# Altium project PCB_Project1.PrjPCB
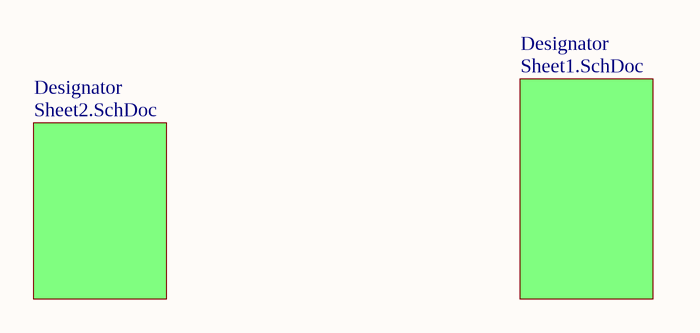
[diagram p0: Sheet3.SchDoc]
7 sheets, 94 parts. Net scope: global (net labels, ports and power ports of the same name join across sheets).
Board file: PCB1.PcbDoc
Sheets:
  Sheet3.SchDoc
    Designator = Sheet2.SchDoc
    Designator = Sheet1.SchDoc
  Power.SchDoc
  MCU.SchDoc
  Connection.SchDoc
  General.SchDoc

## Sheet Sheet3.SchDoc
size A3

### Sub-sheets
Designator = Sheet2.SchDoc: no entries
Designator = Sheet1.SchDoc: no entries

## Sheet Sheet2.SchDoc
size A3
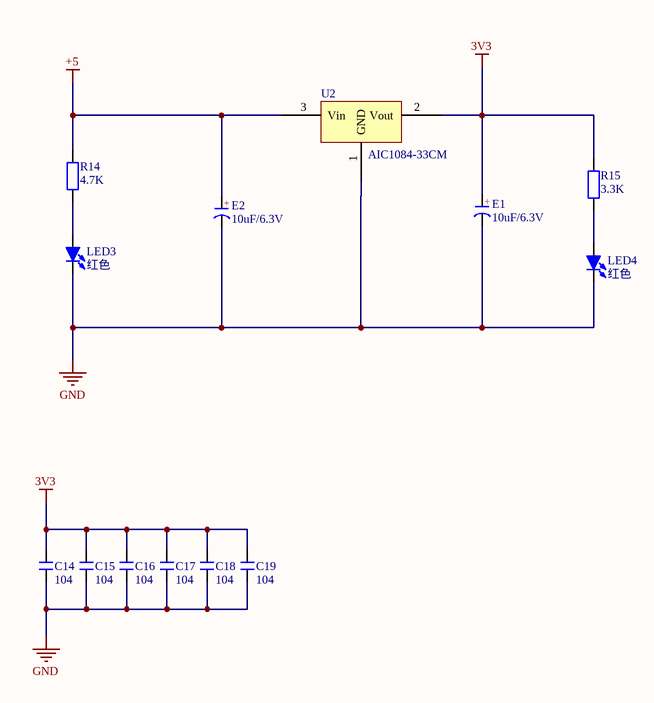
[diagram p1: Sheet2.SchDoc]

### Parts
C14  104  [C 0603_L]
C15  104  [C 0603_L]
C16  104  [C 0603_L]
C17  104  [C 0603_L]
C18  104  [C 0603_L]
C19  104  [C 0603_L]
E1  10uF/6.3V  [CD A(3216)]
E2  10uF/6.3V  [CD A(3216)]
LED3  红色  [LED 0603R]
LED4  红色  [LED 0603B]
R14  4.7K  [R 0603_L]
R15  3.3K  [R 0603_L]
U2  AIC1084-33CM  [TO263-3B]

### Nets
3V3: C14.2 C15.2 C16.2 C17.2 C18.2 C19.2 E1.1(A) R15.1 U2.2(Vout)  [project net VDDA]
+5: E2.1(A) R14.1 U2.3(Vin)
GND: C14.1 C15.1 C16.1 C17.1 C18.1 C19.1 E1.2(K) E2.2(K) LED3.2(K) LED4.2(K) U2.1(GND)  [project net VSSA]
NetLED3_1: LED3.1(A) R14.2
NetLED4_1: LED4.1(A) R15.2

### Notes on the sheet
- (in symbol C-CD) +

### Library data of the parts
C14-C19 = C: 无极性贴片电容; 版权归属: 源创客; BOM名称: 无极性贴片电容; 学习资源: www.ooocke.com
E1 E2 = C-CD: 贴片钽电容; 版权归属: 源创客; BOM名称: 贴片钽电容; 学习资源: www.ooocke.com
LED3 LED4 = LED-SMD: 贴片LED; 版权归属: 源创客; BOM名称: 贴片LED; 学习资源: www.ooocke.com
R14 R15 = R: 贴片电阻; 版权归属: 源创客; BOM名称: 贴片电阻; 学习资源: www.ooocke.com
U2 = AIC1084-33CM: pin to pad: 1>G 2>D 3>S

## Sheet Sheet1.SchDoc
size A3
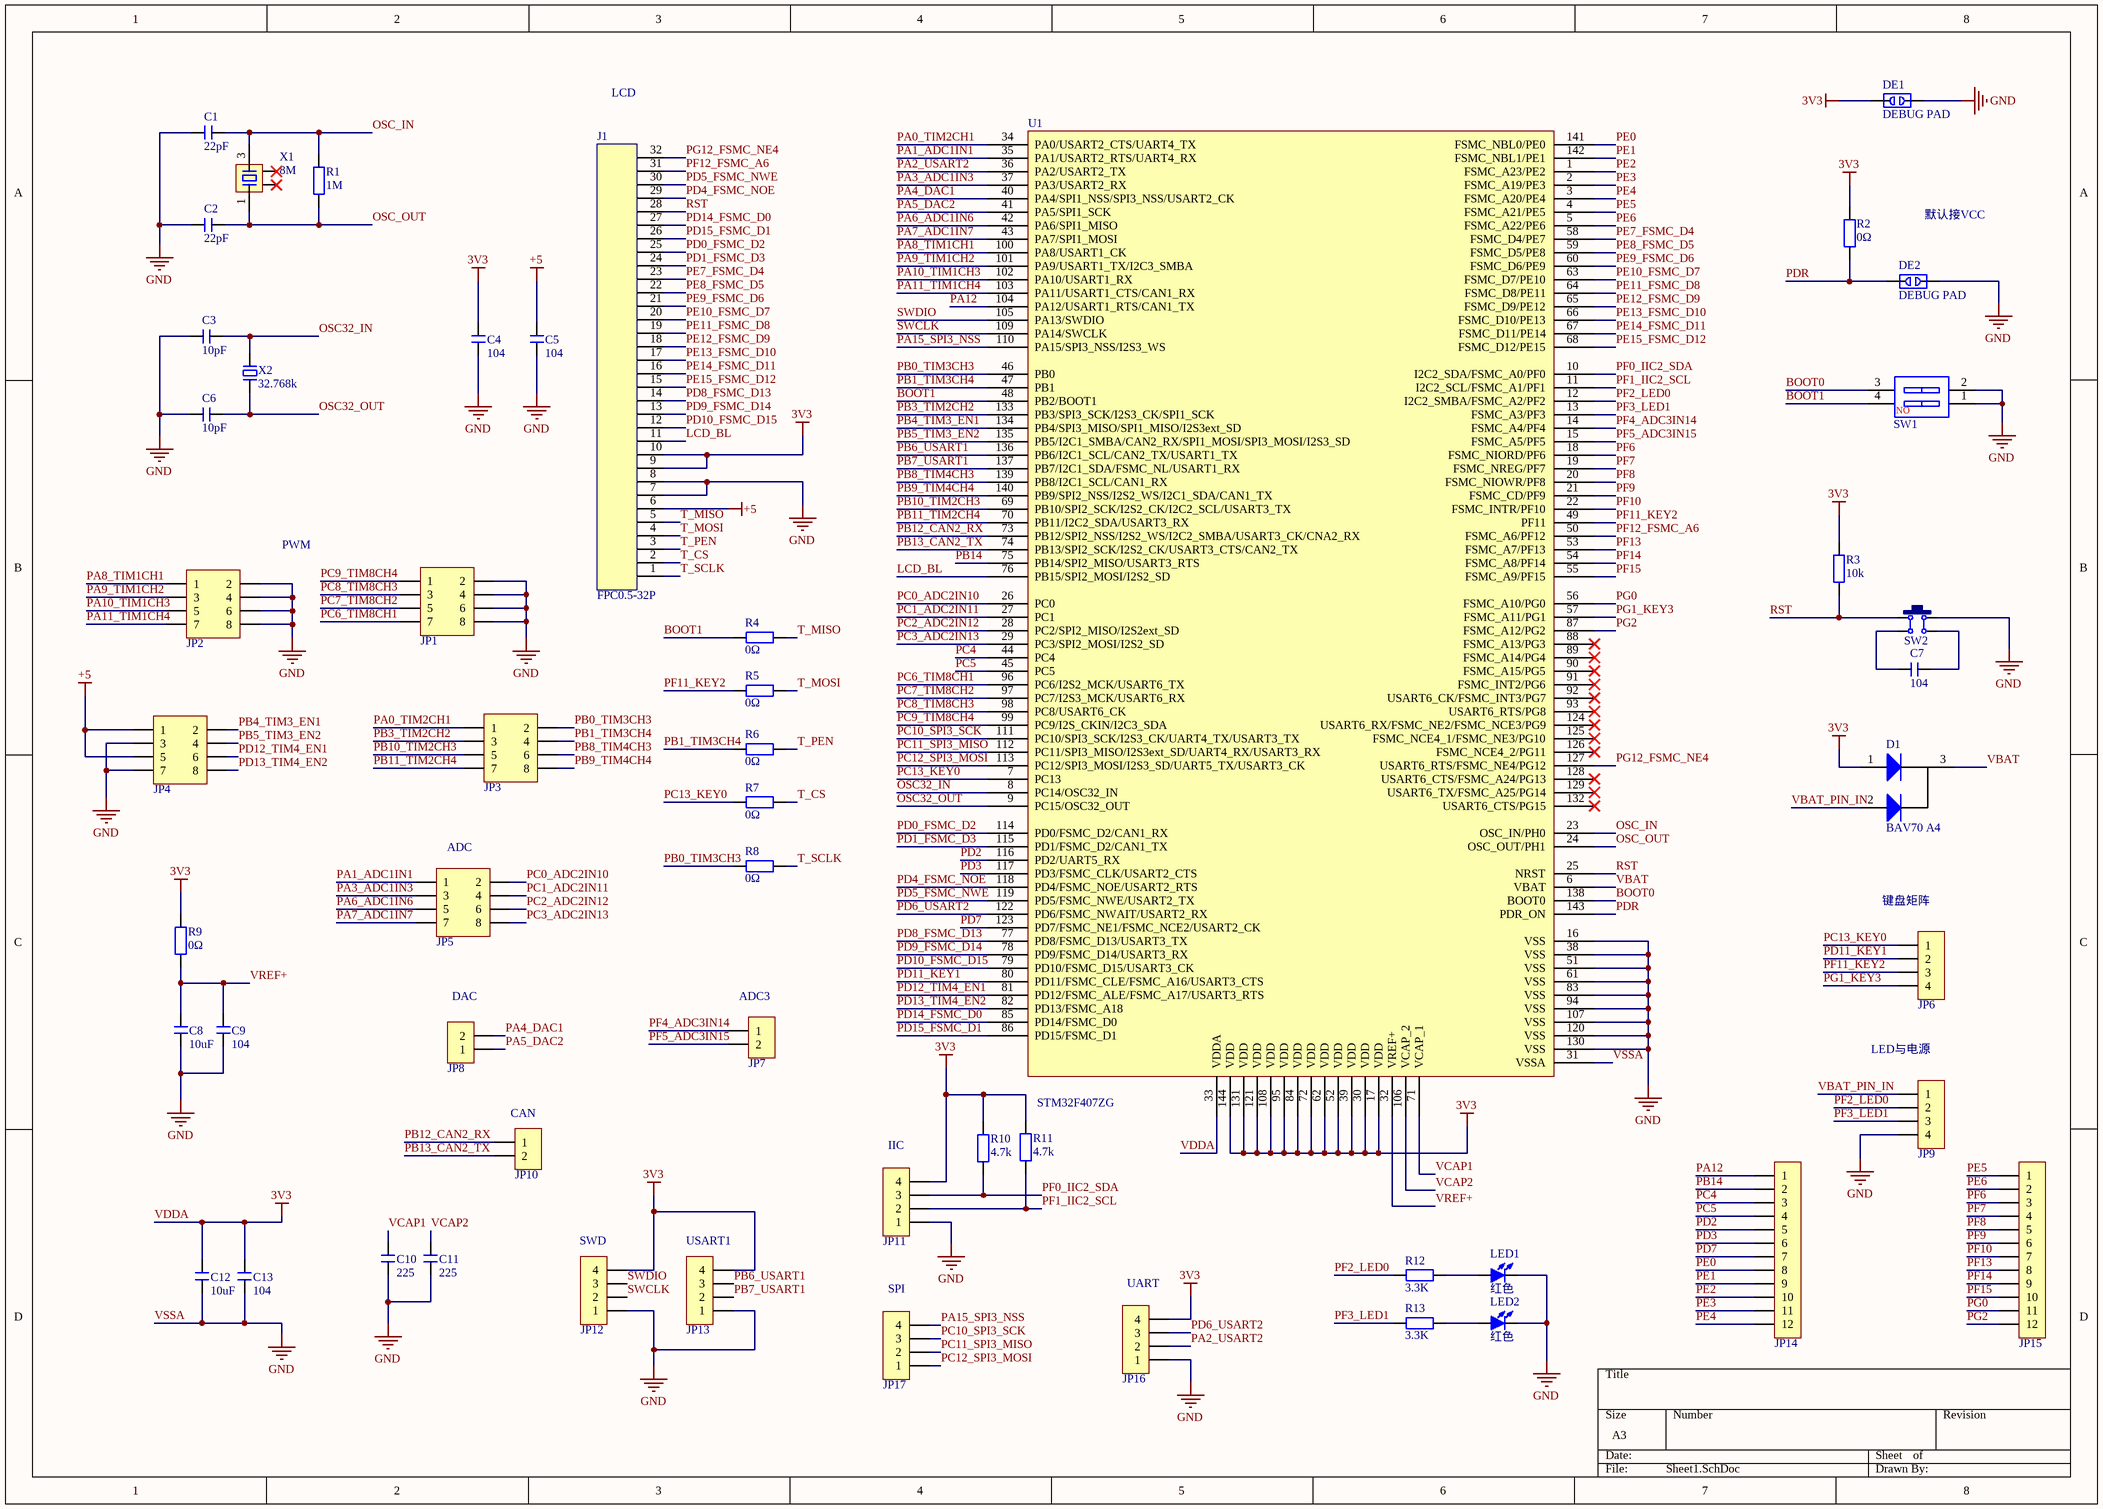
[diagram p2: Sheet1.SchDoc]

### Parts
C1  22pF  [C 0603_L]
C2  22pF  [C 0603_L]
C3  10pF  [C 0603_L]
C4  104  [C 0603_L]
C5  104  [C 0603_L]
C6  10pF  [C 0603_L]
C7  104  [C 0603_L]
C8  10uF  [C 0603_L]
C9  104  [C 0603_L]
C10  225  [C 0603_L]
C11  225  [C 0603_L]
C12  10uF  [C 0603_L]
C13  104  [C 0603_L]
D1  BAV70 A4  [SOT-23(SOT-23-3)]
DE1  DEBUG PAD  [DEBUG_A]
DE2  DEBUG PAD  [DEBUG_A]
J1  FPC0.5-32P  [FPC0.5-32P]
JP1  Header 4X2  [HDR2.54-LI-2x4P]  (value not drawn)
JP2  Header 4X2  [HDR2.54-LI-2x4P]  (value not drawn)
JP3  Header 4X2  [HDR2.54-LI-2x4P]  (value not drawn)
JP4  Header 4X2  [HDR2.54-LI-2x4P]  (value not drawn)
JP5  Header 4X2  [HDR2.54-LI-2x4P]  (value not drawn)
JP6  HDR-1X4  [HDR2.54-LI-4P]  (value not drawn)
JP7  HDR-1X2  [KF128-3.81-2P]  (value not drawn)
JP8  HDR-1X2  [HDR2.54-LI-2P]  (value not drawn)
JP9  HDR-1X4  [HDR2.54-LI-4P]  (value not drawn)
JP10  HDR-1X2  [KF350-2P]  (value not drawn)
JP11  HDR-1X4  [HDR2.54-LI-4P]  (value not drawn)
JP12  HDR-1X4  [HDR2.54-LI-4P]  (value not drawn)
JP13  HDR-1X4  [HDR2.54-LI-4P]  (value not drawn)
JP14  HDR-1X12  [HDR2.54-LI-12P]  (value not drawn)
JP15  HDR-1X12  [HDR2.54-LI-12P]  (value not drawn)
JP16  HDR-1X4  [HDR2.54-LI-4P]  (value not drawn)
JP17  HDR-1X4  [HDR2.54-LI-4P]  (value not drawn)
LED1  红色  [LED 0603R]
LED2  红色  [LED 0603B]
R1  1M  [R 0603_L]
R2  0Ω  [R 0603_L]
R3  10k  [R 0603_L]
R4  0Ω  [R 0603_L]
R5  0Ω  [R 0603_L]
R6  0Ω  [R 0603_L]
R7  0Ω  [R 0603_L]
R8  0Ω  [R 0603_L]
R9  0Ω  [R 0603_L]
R10  4.7k  [R 0603_L]
R11  4.7k  [R 0603_L]
R12  3.3K  [R 0603_L]
R13  3.3K  [R 0603_L]
SW1  CSW-2P  [CSW DIP-2P]  (value not drawn)
SW2  6x6x5  [TSW SMD-6*6*4.3]  (value not drawn)
U1  STM32F407ZG  [LQFP144 20X20_L]
X1  8M  [OSC 1612-4P]
X2  32.768k  [OSC HC-49S]

### Nets
+5: C5.2 J1.6 JP4.1 JP4.5
VDDA: C4.2 C12.2 C13.2 D1.1(A) DE1.1 J1.9 J1.10 JP11.4 JP12.4 JP13.4 JP16.4 R2.2 R3.1 R9.2 R10.1 R11.1 U1.17(VDD) U1.30(VDD) U1.33(VDDA) U1.39(VDD) U1.52(VDD) U1.62(VDD) U1.72(VDD) U1.84(VDD) U1.95(VDD) U1.108(VDD) U1.121(VDD) U1.131(VDD) U1.144(VDD)  [also labelled 3V3]
VSSA: C1.2 C2.2 C3.2 C4.1 C5.1 C6.2 C8.1 C9.1 C10.1 C11.1 C12.1 C13.1 DE1.2 DE2.2 J1.7 J1.8 JP1.2 JP1.4 JP1.6 JP1.8 JP2.2 JP2.4 JP2.6 JP2.8 JP4.3 JP4.7 JP9.4 JP11.1 JP12.1 JP13.1 JP16.1 LED1.2(K) LED2.2(K) SW1.1 SW1.2 SW2.2 U1.16(VSS) U1.31(VSSA) U1.38(VSS) U1.51(VSS) U1.61(VSS) U1.83(VSS) U1.94(VSS) U1.107(VSS) U1.120(VSS) U1.130(VSS)  [also labelled GND]
BOOT0: SW1.3 U1.138(BOOT0)
BOOT1: R4.2 SW1.4 U1.48(PB2/BOOT1)
LCD_BL: J1.11 U1.76(PB15/SPI2_MOSI/I2S2_SD)
OSC32_IN: C3.1 U1.8(PC14/OSC32_IN) X2.2
OSC32_OUT: C6.1 U1.9(PC15/OSC32_OUT) X2.1
OSC_IN: C1.1 R1.1 U1.23(OSC_IN/PH0) X1.3
OSC_OUT: C2.1 R1.2 U1.24(OSC_OUT/PH1) X1.1
PA0_TIM2CH1: JP3.1 U1.34(PA0/USART2_CTS/UART4_TX)
PA1_ADC1IN1: JP5.1 U1.35(PA1/USART2_RTS/UART4_RX)
PA2_USART2: JP16.2 U1.36(PA2/USART2_TX)
PA3_ADC1IN3: JP5.3 U1.37(PA3/USART2_RX)
PA4_DAC1: JP8.2 U1.40(PA4/SPI1_NSS/SPI3_NSS/USART2_CK)
PA5_DAC2: JP8.1 U1.41(PA5/SPI1_SCK)
PA6_ADC1IN6: JP5.5 U1.42(PA6/SPI1_MISO)
PA7_ADC1IN7: JP5.7 U1.43(PA7/SPI1_MOSI)
PA8_TIM1CH1: JP2.1 U1.100(PA8/USART1_CK)
PA9_TIM1CH2: JP2.3 U1.101(PA9/USART1_TX/I2C3_SMBA)
PA10_TIM1CH3: JP2.5 U1.102(PA10/USART1_RX)
PA11_TIM1CH4: JP2.7 U1.103(PA11/USART1_CTS/CAN1_RX)
PA12: JP14.1 U1.104(PA12/USART1_RTS/CAN1_TX)
PA15_SPI3_NSS: JP17.4 U1.110(PA15/SPI3_NSS/I2S3_WS)
PB0_TIM3CH3: JP3.2 R8.2 U1.46(PB0)
PB1_TIM3CH4: JP3.4 R6.2 U1.47(PB1)
PB3_TIM2CH2: JP3.3 U1.133(PB3/SPI3_SCK/I2S3_CK/SPI1_SCK)
PB4_TIM3_EN1: JP4.2 U1.134(PB4/SPI3_MISO/SPI1_MISO/I2S3ext_SD)
PB5_TIM3_EN2: JP4.4 U1.135(PB5/I2C1_SMBA/CAN2_RX/SPI1_MOSI/SPI3_MOSI/I2S3_SD)
PB6_USART1: JP13.3 U1.136(PB6/I2C1_SCL/CAN2_TX/USART1_TX)
PB7_USART1: JP13.2 U1.137(PB7/I2C1_SDA/FSMC_NL/USART1_RX)
PB8_TIM4CH3: JP3.6 U1.139(PB8/I2C1_SCL/CAN1_RX)
PB9_TIM4CH4: JP3.8 U1.140(PB9/SPI2_NSS/I2S2_WS/I2C1_SDA/CAN1_TX)
PB10_TIM2CH3: JP3.5 U1.69(PB10/SPI2_SCK/I2S2_CK/I2C2_SCL/USART3_TX)
PB11_TIM2CH4: JP3.7 U1.70(PB11/I2C2_SDA/USART3_RX)
PB12_CAN2_RX: JP10.1 U1.73(PB12/SPI2_NSS/I2S2_WS/I2C2_SMBA/USART3_CK/CNA2_RX)
PB13_CAN2_TX: JP10.2 U1.74(PB13/SPI2_SCK/I2S2_CK/USART3_CTS/CAN2_TX)
PB14: JP14.2 U1.75(PB14/SPI2_MISO/USART3_RTS)
PC0_ADC2IN10: JP5.2 U1.26(PC0)
PC1_ADC2IN11: JP5.4 U1.27(PC1)
PC2_ADC2IN12: JP5.6 U1.28(PC2/SPI2_MISO/I2S2ext_SD)
PC3_ADC2IN13: JP5.8 U1.29(PC3/SPI2_MOSI/I2S2_SD)
PC4: JP14.3 U1.44(PC4)
PC5: JP14.4 U1.45(PC5)
PC6_TIM8CH1: JP1.7 U1.96(PC6/I2S2_MCK/USART6_TX)
PC7_TIM8CH2: JP1.5 U1.97(PC7/I2S3_MCK/USART6_RX)
PC8_TIM8CH3: JP1.3 U1.98(PC8/USART6_CK)
PC9_TIM8CH4: JP1.1 U1.99(PC9/I2S_CKIN/I2C3_SDA)
PC10_SPI3_SCK: JP17.3 U1.111(PC10/SPI3_SCK/I2S3_CK/UART4_TX/USART3_TX)
PC11_SPI3_MISO: JP17.2 U1.112(PC11/SPI3_MISO/I2S3ext_SD/UART4_RX/USART3_RX)
PC12_SPI3_MOSI: JP17.1 U1.113(PC12/SPI3_MOSI/I2S3_SD/UART5_TX/USART3_CK)
PC13_KEY0: JP6.1 R7.2 U1.7(PC13)
PD0_FSMC_D2: J1.25 U1.114(PD0/FSMC_D2/CAN1_RX)
PD1_FSMC_D3: J1.24 U1.115(PD1/FSMC_D2/CAN1_TX)
PD2: JP14.5 U1.116(PD2/UART5_RX)
PD3: JP14.6 U1.117(PD3/FSMC_CLK/USART2_CTS)
PD4_FSMC_NOE: J1.29 U1.118(PD4/FSMC_NOE/USART2_RTS)
PD5_FSMC_NWE: J1.30 U1.119(PD5/FSMC_NWE/USART2_TX)
PD6_USART2: JP16.3 U1.122(PD6/FSMC_NWAIT/USART2_RX)
PD7: JP14.7 U1.123(PD7/FSMC_NE1/FSMC_NCE2/USART2_CK)
PD8_FSMC_D13: J1.14 U1.77(PD8/FSMC_D13/USART3_TX)
PD9_FSMC_D14: J1.13 U1.78(PD9/FSMC_D14/USART3_RX)
PD10_FSMC_D15: J1.12 U1.79(PD10/FSMC_D15/USART3_CK)
PD11_KEY1: JP6.2 U1.80(PD11/FSMC_CLE/FSMC_A16/USART3_CTS)
PD12_TIM4_EN1: JP4.6 U1.81(PD12/FSMC_ALE/FSMC_A17/USART3_RTS)
PD13_TIM4_EN2: JP4.8 U1.82(PD13/FSMC_A18)
PD14_FSMC_D0: J1.27 U1.85(PD14/FSMC_D0)
PD15_FSMC_D1: J1.26 U1.86(PD15/FSMC_D1)
PDR: DE2.1 R2.1 U1.143(PDR_ON)
PE0: JP14.8 U1.141(FSMC_NBL0/PE0)
PE1: JP14.9 U1.142(FSMC_NBL1/PE1)
PE2: JP14.10 U1.1(FSMC_A23/PE2)
PE3: JP14.11 U1.2(FSMC_A19/PE3)
PE4: JP14.12 U1.3(FSMC_A20/PE4)
PE5: JP15.1 U1.4(FSMC_A21/PE5)
PE6: JP15.2 U1.5(FSMC_A22/PE6)
PE7_FSMC_D4: J1.23 U1.58(FSMC_D4/PE7)
PE8_FSMC_D5: J1.22 U1.59(FSMC_D5/PE8)
PE9_FSMC_D6: J1.21 U1.60(FSMC_D6/PE9)
PE10_FSMC_D7: J1.20 U1.63(FSMC_D7/PE10)
PE11_FSMC_D8: J1.19 U1.64(FSMC_D8/PE11)
PE12_FSMC_D9: J1.18 U1.65(FSMC_D9/PE12)
PE13_FSMC_D10: J1.17 U1.66(FSMC_D10/PE13)
PE14_FSMC_D11: J1.16 U1.67(FSMC_D11/PE14)
PE15_FSMC_D12: J1.15 U1.68(FSMC_D12/PE15)
PF0_IIC2_SDA: JP11.3 R10.2 U1.10(I2C2_SDA/FSMC_A0/PF0)
PF1_IIC2_SCL: JP11.2 R11.2 U1.11(I2C2_SCL/FSMC_A1/PF1)
PF2_LED0: JP9.2 R12.1 U1.12(I2C2_SMBA/FSMC_A2/PF2)
PF3_LED1: JP9.3 R13.1 U1.13(FSMC_A3/PF3)
PF4_ADC3IN14: JP7.1 U1.14(FSMC_A4/PF4)
PF5_ADC3IN15: JP7.2 U1.15(FSMC_A5/PF5)
PF6: JP15.3 U1.18(FSMC_NIORD/PF6)
PF7: JP15.4 U1.19(FSMC_NREG/PF7)
PF8: JP15.5 U1.20(FSMC_NIOWR/PF8)
PF9: JP15.6 U1.21(FSMC_CD/PF9)
PF10: JP15.7 U1.22(FSMC_INTR/PF10)
PF11_KEY2: JP6.3 R5.2 U1.49(PF11)
PF12_FSMC_A6: J1.31 U1.50(FSMC_A6/PF12)
PF13: JP15.8 U1.53(FSMC_A7/PF13)
PF14: JP15.9 U1.54(FSMC_A8/PF14)
PF15: JP15.10 U1.55(FSMC_A9/PF15)
PG0: JP15.11 U1.56(FSMC_A10/PG0)
PG1_KEY3: JP6.4 U1.57(FSMC_A11/PG1)
PG2: JP15.12 U1.87(FSMC_A12/PG2)
PG12_FSMC_NE4: J1.32 U1.127(USART6_RTS/FSMC_NE4/PG12)
RST: J1.28 R3.2 SW2.1 U1.25(NRST)
SWCLK: JP12.2 U1.109(PA14/SWCLK)
SWDIO: JP12.3 U1.105(PA13/SWDIO)
T_CS: J1.2 R7.1
T_MISO: J1.5 R4.1
T_MOSI: J1.4 R5.1
T_PEN: J1.3 R6.1
T_SCLK: J1.1 R8.1
VBAT: D1.3(K) U1.6(VBAT)
VBAT_PIN_IN: D1.2(A) JP9.1
VCAP1: C10.2 U1.71(VCAP_1)
VCAP2: C11.2 U1.106(VCAP_2)
VREF+: C8.2 C9.2 R9.1 U1.32(VREF+)
NetC7_1: C7.1 SW2.4
NetC7_2: C7.2 SW2.3
NetLED1_1: LED1.1(A) R12.2
NetLED2_1: LED2.1(A) R13.2

Not connected (* = marked no-connect by the designer): U1 88(FSMC_A13/PG3)* 89(FSMC_A14/PG4)* 90(FSMC_A15/PG5)* 91(FSMC_INT2/PG6)* 92(USART6_CK/FSMC_INT3/PG7)* 93(USART6_RTS/PG8)* 124(USART6_RX/FSMC_NE2/FSMC_NCE3/PG9)* 125(FSMC_NCE4_1/FSMC_NE3/PG10)* 126(FSMC_NCE4_2/PG11)* 128(USART6_CTS/FSMC_A24/PG13)* 129(USART6_TX/FSMC_A25/PG14)* 132(USART6_CTS/PG15)*; X1 2* 4*

### Notes on the sheet
- LCD
- 默认接VCC
- (near JP2) PWM
- (near JP5) ADC
- (near JP6) 键盘矩阵
- (near JP8) DAC
- (near JP7) ADC3
- LED与电源
- (near JP10) CAN
- (near JP11) IIC
- (near JP12) SWD
- (near JP13) USART1
- (near JP17) SPI
- (near JP16) UART
- (in symbol CSW-2P) NO

### Library data of the parts
C1-C13 = C: 无极性贴片电容; 版权归属: 源创客; BOM名称: 无极性贴片电容; 学习资源: www.ooocke.com
D1 = SOT-23 BAV70 A4: 开关二极管; ComponentLink1Description: 供应商链接; ComponentLink1URL: http://www.szlcsc.com/product/details_70091.html; Package: SOT-23; Supplier: LC; SuppliersPartNumber: C68978
DE1 DE2 = DEBUG: 调试断点焊盘; 版权归属: 源创客; BOM名称: 调试断点焊盘; 学习资源: www.ooocke.com
J1 = FPC0.5-32P: 贴片
JP1-JP5 = Header 4X2: 4*2P接插件; 版权归属: 源创客; BOM名称: 4*2P接插件; 学习资源: www.ooocke.com
JP6 JP9 JP11-JP13 JP16 JP17 = Header 4: 4P接插件; 版权归属: 源创客; BOM名称: 4P接插件; 学习资源: www.ooocke.com
JP7 JP8 JP10 = Header 2: 2P接插件; 版权归属: 源创客; BOM名称: 2P接插件; 学习资源: www.ooocke.com
JP14 JP15 = Header 12: 12P接插件; 版权归属: 源创客; BOM名称: 12P接插件; 学习资源: www.ooocke.com
LED1 LED2 = LED-SMD: 贴片LED; 版权归属: 源创客; BOM名称: 贴片LED; 学习资源: www.ooocke.com
R1-R13 = R: 贴片电阻; 版权归属: 源创客; BOM名称: 贴片电阻; 学习资源: www.ooocke.com
SW1 = CSW-2P: 2路编码开关; 版权归属: 源创客; BOM名称: 2路编码开关; 学习资源: www.ooocke.com
SW2 = TSW SMD-6x6: 贴片6x6轻触开关; 版权归属: 源创客; BOM名称: 贴片6x6轻触开关; 学习资源: www.ooocke.com
U1 = STM32F407ZG: Flaah:1024/RAM:192/IO:114; BOM名称: 32位ST单片机; 版权归属: 源创客; 学习资源: www.ooocke.com
X1 = XTAL-4P: 4脚无源晶振; 版权归属: 源创客; BOM名称: 4脚无源晶振; 学习资源: www.ooocke.com
X2 = XTAL-2P: 2脚无源脚晶振; 版权归属: 源创客; BOM名称: 2脚无源脚晶振; 学习资源: www.ooocke.com

## Sheet Power.SchDoc
size A3

## Sheet MCU.SchDoc
size A3
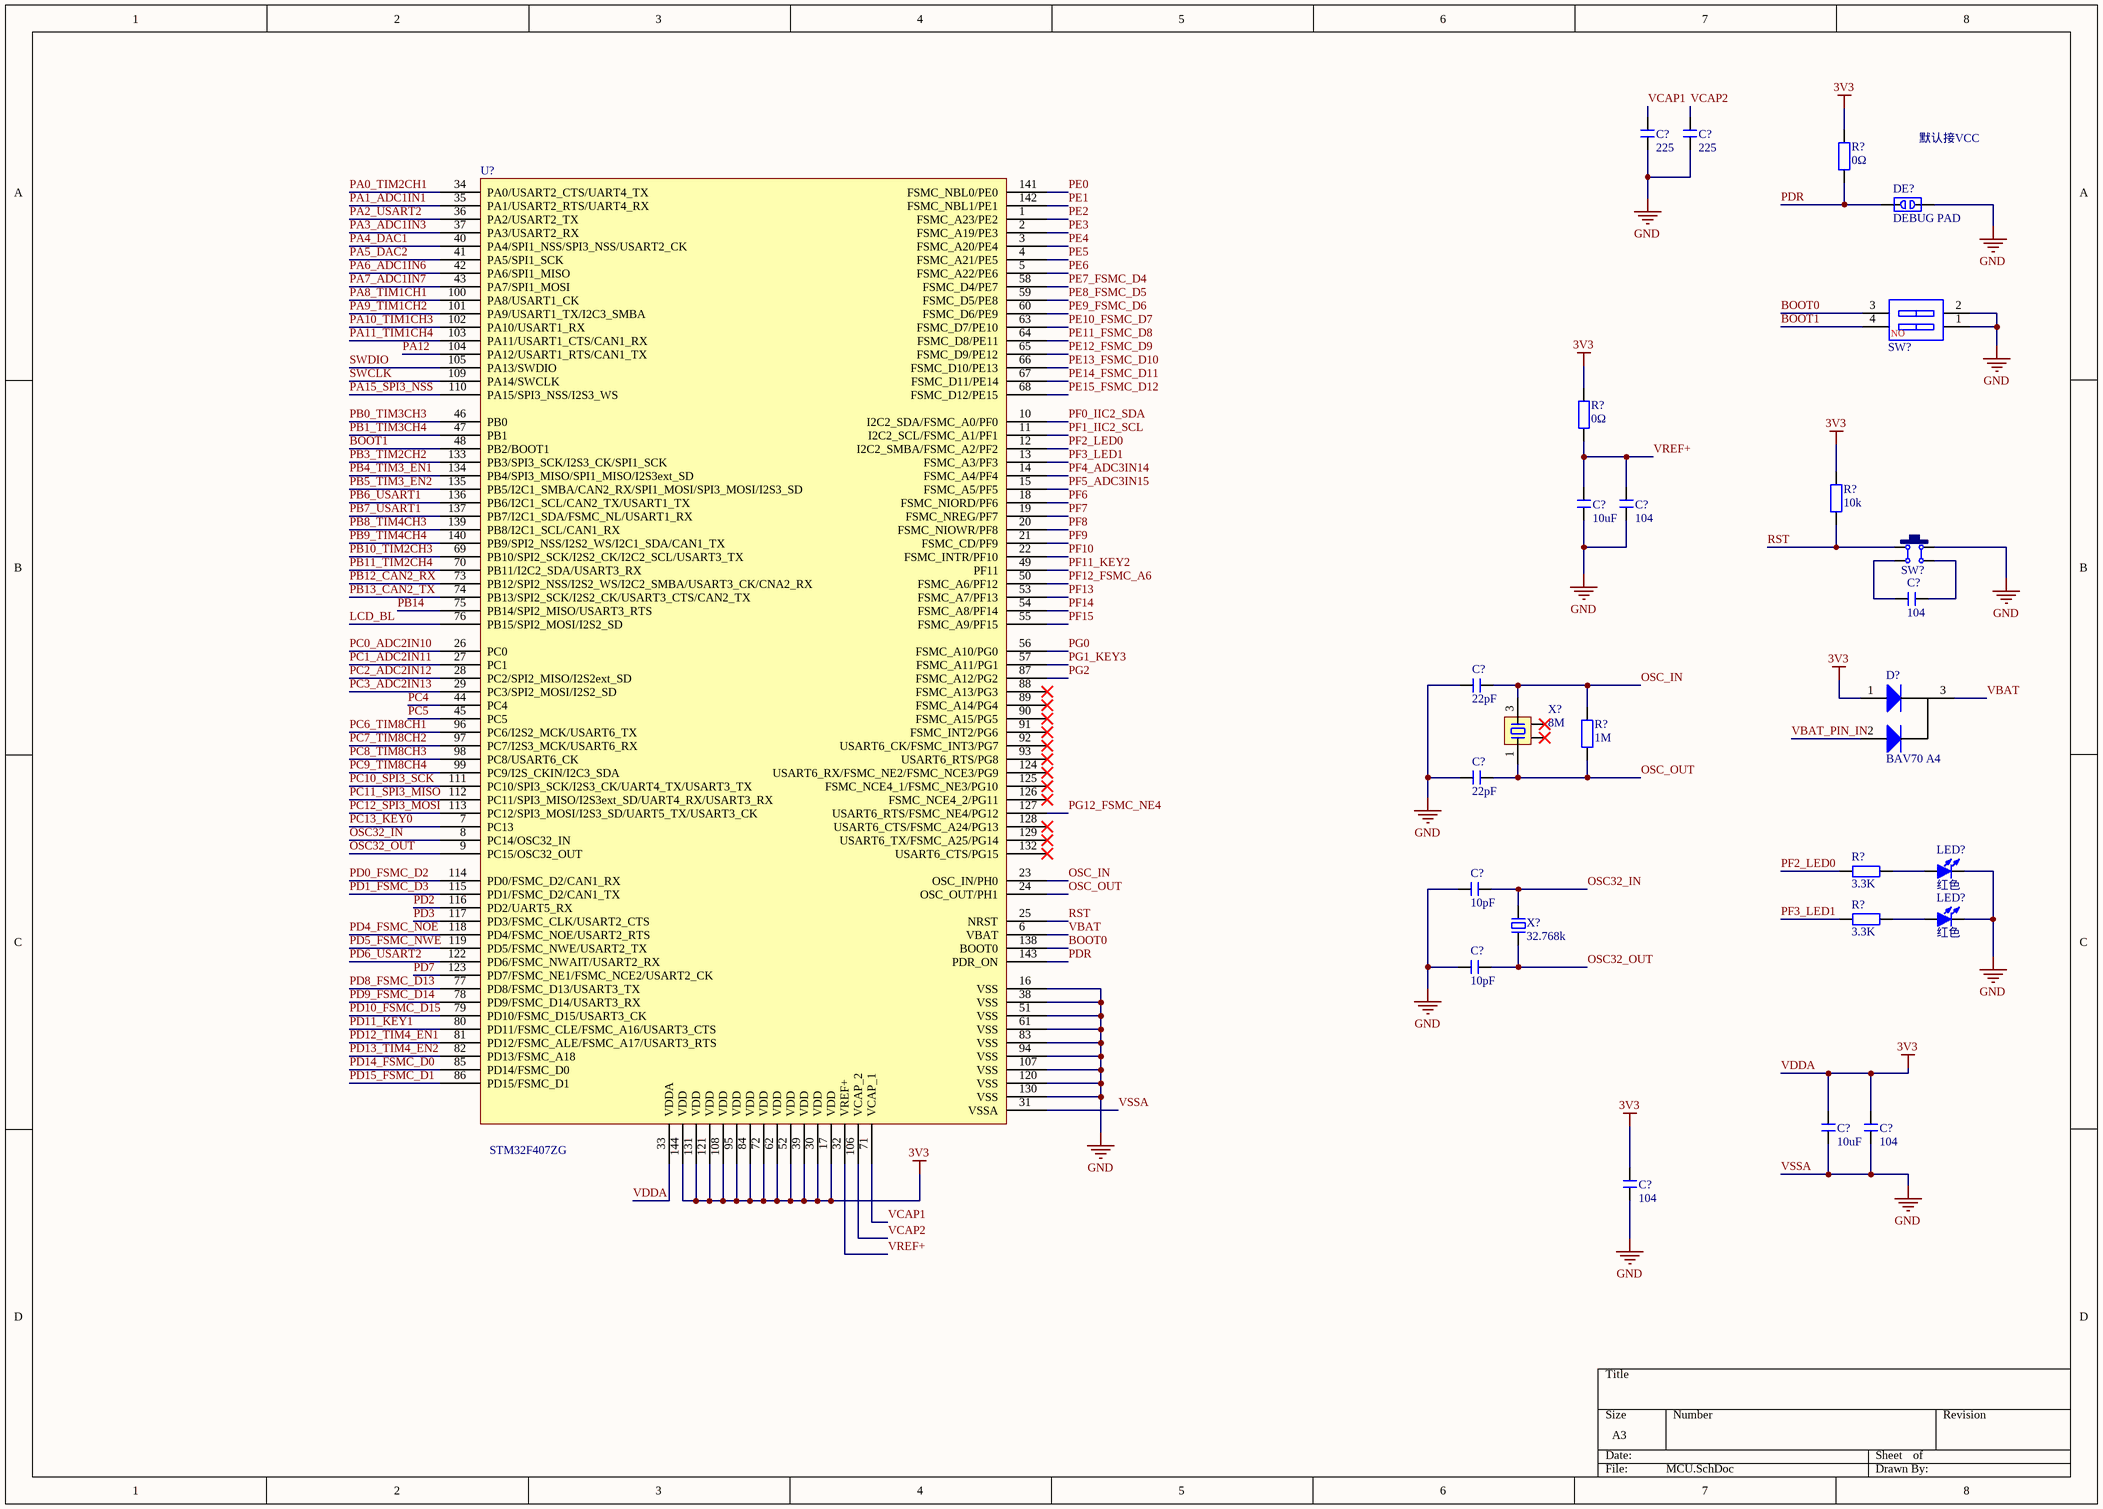
[diagram p3: MCU.SchDoc]

### Parts
(Parts that share a designator on the sheet are numbered #1, #2 ... from top to bottom, then left to right.)
C?#1  225  [C 0603_L]
C?#2  225  [C 0603_L]
C?#3  10uF  [C 0603_L]
C?#4  104  [C 0603_L]
C?#5  104  [C 0603_L]
C?#6  22pF  [C 0603_L]
C?#7  22pF  [C 0603_L]
C?#8  10pF  [C 0603_L]
C?#9  10pF  [C 0603_L]
C?#10  10uF  [C 0603_L]
C?#11  104  [C 0603_L]
C?#12  104  [C 0603_L]
D?  BAV70 A4  [SOT-23(SOT-23-3)]
DE?  DEBUG PAD  [DEBUG_A]
LED?#1  红色  [LED 0603R]
LED?#2  红色  [LED 0603B]
R?#1  0Ω  [R 0603_L]
R?#2  0Ω  [R 0603_L]
R?#3  10k  [R 0603_L]
R?#4  1M  [R 0603_L]
R?#5  3.3K  [R 0603_L]
R?#6  3.3K  [R 0603_L]
SW?#1  CSW-2P  [CSW DIP-2P]  (value not drawn)
SW?#2  6x6x5  [TSW SMD-6*6*4.3]  (value not drawn)
U?  STM32F407ZG  [LQFP144 20X20_L]
X?#1  8M  [OSC 1612-4P]
X?#2  32.768k  [OSC HC-49S]

### Nets
VDDA: C?#10.2 C?#11.2 C?#12.2 D?.1(A) R?#1.2 R?#2.2 R?#3.1 U?.17(VDD) U?.30(VDD) U?.33(VDDA) U?.39(VDD) U?.52(VDD) U?.62(VDD) U?.72(VDD) U?.84(VDD) U?.95(VDD) U?.108(VDD) U?.121(VDD) U?.131(VDD) U?.144(VDD)  [also labelled 3V3]
VSSA: C?#1.1 C?#2.1 C?#3.1 C?#4.1 C?#6.2 C?#7.2 C?#8.2 C?#9.2 C?#10.1 C?#11.1 C?#12.1 DE?.2 LED?#1.2(K) LED?#2.2(K) SW?#1.1 SW?#1.2 SW?#2.2 U?.16(VSS) U?.31(VSSA) U?.38(VSS) U?.51(VSS) U?.61(VSS) U?.83(VSS) U?.94(VSS) U?.107(VSS) U?.120(VSS) U?.130(VSS)  [also labelled GND]
BOOT0: SW?#1.3 U?.138(BOOT0)
BOOT1: SW?#1.4 U?.48(PB2/BOOT1)
LCD_BL: U?.76(PB15/SPI2_MOSI/I2S2_SD)
OSC32_IN: C?#8.1 U?.8(PC14/OSC32_IN) X?#2.2
OSC32_OUT: C?#9.1 U?.9(PC15/OSC32_OUT) X?#2.1
OSC_IN: C?#6.1 R?#4.1 U?.23(OSC_IN/PH0) X?#1.3
OSC_OUT: C?#7.1 R?#4.2 U?.24(OSC_OUT/PH1) X?#1.1
PA0_TIM2CH1: U?.34(PA0/USART2_CTS/UART4_TX)
PA1_ADC1IN1: U?.35(PA1/USART2_RTS/UART4_RX)
PA2_USART2: U?.36(PA2/USART2_TX)
PA3_ADC1IN3: U?.37(PA3/USART2_RX)
PA4_DAC1: U?.40(PA4/SPI1_NSS/SPI3_NSS/USART2_CK)
PA5_DAC2: U?.41(PA5/SPI1_SCK)
PA6_ADC1IN6: U?.42(PA6/SPI1_MISO)
PA7_ADC1IN7: U?.43(PA7/SPI1_MOSI)
PA8_TIM1CH1: U?.100(PA8/USART1_CK)
PA9_TIM1CH2: U?.101(PA9/USART1_TX/I2C3_SMBA)
PA10_TIM1CH3: U?.102(PA10/USART1_RX)
PA11_TIM1CH4: U?.103(PA11/USART1_CTS/CAN1_RX)
PA12: U?.104(PA12/USART1_RTS/CAN1_TX)
PA15_SPI3_NSS: U?.110(PA15/SPI3_NSS/I2S3_WS)
PB0_TIM3CH3: U?.46(PB0)
PB1_TIM3CH4: U?.47(PB1)
PB3_TIM2CH2: U?.133(PB3/SPI3_SCK/I2S3_CK/SPI1_SCK)
PB4_TIM3_EN1: U?.134(PB4/SPI3_MISO/SPI1_MISO/I2S3ext_SD)
PB5_TIM3_EN2: U?.135(PB5/I2C1_SMBA/CAN2_RX/SPI1_MOSI/SPI3_MOSI/I2S3_SD)
PB6_USART1: U?.136(PB6/I2C1_SCL/CAN2_TX/USART1_TX)
PB7_USART1: U?.137(PB7/I2C1_SDA/FSMC_NL/USART1_RX)
PB8_TIM4CH3: U?.139(PB8/I2C1_SCL/CAN1_RX)
PB9_TIM4CH4: U?.140(PB9/SPI2_NSS/I2S2_WS/I2C1_SDA/CAN1_TX)
PB10_TIM2CH3: U?.69(PB10/SPI2_SCK/I2S2_CK/I2C2_SCL/USART3_TX)
PB11_TIM2CH4: U?.70(PB11/I2C2_SDA/USART3_RX)
PB12_CAN2_RX: U?.73(PB12/SPI2_NSS/I2S2_WS/I2C2_SMBA/USART3_CK/CNA2_RX)
PB13_CAN2_TX: U?.74(PB13/SPI2_SCK/I2S2_CK/USART3_CTS/CAN2_TX)
PB14: U?.75(PB14/SPI2_MISO/USART3_RTS)
PC0_ADC2IN10: U?.26(PC0)
PC1_ADC2IN11: U?.27(PC1)
PC2_ADC2IN12: U?.28(PC2/SPI2_MISO/I2S2ext_SD)
PC3_ADC2IN13: U?.29(PC3/SPI2_MOSI/I2S2_SD)
PC4: U?.44(PC4)
PC5: U?.45(PC5)
PC6_TIM8CH1: U?.96(PC6/I2S2_MCK/USART6_TX)
PC7_TIM8CH2: U?.97(PC7/I2S3_MCK/USART6_RX)
PC8_TIM8CH3: U?.98(PC8/USART6_CK)
PC9_TIM8CH4: U?.99(PC9/I2S_CKIN/I2C3_SDA)
PC10_SPI3_SCK: U?.111(PC10/SPI3_SCK/I2S3_CK/UART4_TX/USART3_TX)
PC11_SPI3_MISO: U?.112(PC11/SPI3_MISO/I2S3ext_SD/UART4_RX/USART3_RX)
PC12_SPI3_MOSI: U?.113(PC12/SPI3_MOSI/I2S3_SD/UART5_TX/USART3_CK)
PC13_KEY0: U?.7(PC13)
PD0_FSMC_D2: U?.114(PD0/FSMC_D2/CAN1_RX)
PD1_FSMC_D3: U?.115(PD1/FSMC_D2/CAN1_TX)
PD2: U?.116(PD2/UART5_RX)
PD3: U?.117(PD3/FSMC_CLK/USART2_CTS)
PD4_FSMC_NOE: U?.118(PD4/FSMC_NOE/USART2_RTS)
PD5_FSMC_NWE: U?.119(PD5/FSMC_NWE/USART2_TX)
PD6_USART2: U?.122(PD6/FSMC_NWAIT/USART2_RX)
PD7: U?.123(PD7/FSMC_NE1/FSMC_NCE2/USART2_CK)
PD8_FSMC_D13: U?.77(PD8/FSMC_D13/USART3_TX)
PD9_FSMC_D14: U?.78(PD9/FSMC_D14/USART3_RX)
PD10_FSMC_D15: U?.79(PD10/FSMC_D15/USART3_CK)
PD11_KEY1: U?.80(PD11/FSMC_CLE/FSMC_A16/USART3_CTS)
PD12_TIM4_EN1: U?.81(PD12/FSMC_ALE/FSMC_A17/USART3_RTS)
PD13_TIM4_EN2: U?.82(PD13/FSMC_A18)
PD14_FSMC_D0: U?.85(PD14/FSMC_D0)
PD15_FSMC_D1: U?.86(PD15/FSMC_D1)
PDR: DE?.1 R?#1.1 U?.143(PDR_ON)
PE0: U?.141(FSMC_NBL0/PE0)
PE1: U?.142(FSMC_NBL1/PE1)
PE2: U?.1(FSMC_A23/PE2)
PE3: U?.2(FSMC_A19/PE3)
PE4: U?.3(FSMC_A20/PE4)
PE5: U?.4(FSMC_A21/PE5)
PE6: U?.5(FSMC_A22/PE6)
PE7_FSMC_D4: U?.58(FSMC_D4/PE7)
PE8_FSMC_D5: U?.59(FSMC_D5/PE8)
PE9_FSMC_D6: U?.60(FSMC_D6/PE9)
PE10_FSMC_D7: U?.63(FSMC_D7/PE10)
PE11_FSMC_D8: U?.64(FSMC_D8/PE11)
PE12_FSMC_D9: U?.65(FSMC_D9/PE12)
PE13_FSMC_D10: U?.66(FSMC_D10/PE13)
PE14_FSMC_D11: U?.67(FSMC_D11/PE14)
PE15_FSMC_D12: U?.68(FSMC_D12/PE15)
PF0_IIC2_SDA: U?.10(I2C2_SDA/FSMC_A0/PF0)
PF1_IIC2_SCL: U?.11(I2C2_SCL/FSMC_A1/PF1)
PF2_LED0: R?#5.1 U?.12(I2C2_SMBA/FSMC_A2/PF2)
PF3_LED1: R?#6.1 U?.13(FSMC_A3/PF3)
PF4_ADC3IN14: U?.14(FSMC_A4/PF4)
PF5_ADC3IN15: U?.15(FSMC_A5/PF5)
PF6: U?.18(FSMC_NIORD/PF6)
PF7: U?.19(FSMC_NREG/PF7)
PF8: U?.20(FSMC_NIOWR/PF8)
PF9: U?.21(FSMC_CD/PF9)
PF10: U?.22(FSMC_INTR/PF10)
PF11_KEY2: U?.49(PF11)
PF12_FSMC_A6: U?.50(FSMC_A6/PF12)
PF13: U?.53(FSMC_A7/PF13)
PF14: U?.54(FSMC_A8/PF14)
PF15: U?.55(FSMC_A9/PF15)
PG0: U?.56(FSMC_A10/PG0)
PG1_KEY3: U?.57(FSMC_A11/PG1)
PG2: U?.87(FSMC_A12/PG2)
PG12_FSMC_NE4: U?.127(USART6_RTS/FSMC_NE4/PG12)
RST: R?#3.2 SW?#2.1 U?.25(NRST)
SWCLK: U?.109(PA14/SWCLK)
SWDIO: U?.105(PA13/SWDIO)
VBAT: D?.3(K) U?.6(VBAT)
VBAT_PIN_IN: D?.2(A)
VCAP1: C?#1.2 U?.71(VCAP_1)
VCAP2: C?#2.2 U?.106(VCAP_2)
VREF+: C?#3.2 C?#4.2 R?#2.1 U?.32(VREF+)
NetC?#5_1: C?#5.1 SW?#2.4
NetC?#5_2: C?#5.2 SW?#2.3
NetLED?#1_1: LED?#1.1(A) R?#5.2
NetLED?#2_1: LED?#2.1(A) R?#6.2

Not connected (* = marked no-connect by the designer): U? 88(FSMC_A13/PG3)* 89(FSMC_A14/PG4)* 90(FSMC_A15/PG5)* 91(FSMC_INT2/PG6)* 92(USART6_CK/FSMC_INT3/PG7)* 93(USART6_RTS/PG8)* 124(USART6_RX/FSMC_NE2/FSMC_NCE3/PG9)* 125(FSMC_NCE4_1/FSMC_NE3/PG10)* 126(FSMC_NCE4_2/PG11)* 128(USART6_CTS/FSMC_A24/PG13)* 129(USART6_TX/FSMC_A25/PG14)* 132(USART6_CTS/PG15)*; X?#1 2* 4*

### Notes on the sheet
- 默认接VCC
- (in symbol CSW-2P) NO

### Library data of the parts
C?#1-C?#12 = C: 无极性贴片电容; 版权归属: 源创客; BOM名称: 无极性贴片电容; 学习资源: www.ooocke.com
D? = SOT-23 BAV70 A4: 开关二极管; ComponentLink1Description: 供应商链接; ComponentLink1URL: http://www.szlcsc.com/product/details_70091.html; Package: SOT-23; Supplier: LC; SuppliersPartNumber: C68978
DE? = DEBUG: 调试断点焊盘; 版权归属: 源创客; BOM名称: 调试断点焊盘; 学习资源: www.ooocke.com
LED?#1 LED?#2 = LED-SMD: 贴片LED; 版权归属: 源创客; BOM名称: 贴片LED; 学习资源: www.ooocke.com
R?#1-R?#6 = R: 贴片电阻; 版权归属: 源创客; BOM名称: 贴片电阻; 学习资源: www.ooocke.com
SW?#1 = CSW-2P: 2路编码开关; 版权归属: 源创客; BOM名称: 2路编码开关; 学习资源: www.ooocke.com
SW?#2 = TSW SMD-6x6: 贴片6x6轻触开关; 版权归属: 源创客; BOM名称: 贴片6x6轻触开关; 学习资源: www.ooocke.com
U? = STM32F407ZG: as U1 on sheet Sheet1; 学习资源: www.ooocke.com
X?#1 = XTAL-4P: 4脚无源晶振; 版权归属: 源创客; BOM名称: 4脚无源晶振; 学习资源: www.ooocke.com
X?#2 = XTAL-2P: 2脚无源脚晶振; 版权归属: 源创客; BOM名称: 2脚无源脚晶振; 学习资源: www.ooocke.com

## Sheet Connection.SchDoc
size A3

## Sheet General.SchDoc
size A3

## Nets that join several sheets
+5: Sheet2 (E2.1 R14.1 U2.3), Sheet1 (C5.2 J1.6 JP4.1 JP4.5)
VDDA: Sheet2 (9 pins), Sheet1 (29 pins), MCU (20 pins)
VSSA: Sheet2 (11 pins), Sheet1 (46 pins), MCU (27 pins)
BOOT0: Sheet1 (SW1.3 U1.138), MCU (SW?#1.3 U?.138)
BOOT1: Sheet1 (R4.2 SW1.4 U1.48), MCU (SW?#1.4 U?.48)
LCD_BL: Sheet1 (J1.11 U1.76), MCU (U?.76)
OSC32_IN: Sheet1 (C3.1 U1.8 X2.2), MCU (C?#8.1 U?.8 X?#2.2)
OSC32_OUT: Sheet1 (C6.1 U1.9 X2.1), MCU (C?#9.1 U?.9 X?#2.1)
OSC_IN: Sheet1 (C1.1 R1.1 U1.23 X1.3), MCU (C?#6.1 R?#4.1 U?.23 X?#1.3)
OSC_OUT: Sheet1 (C2.1 R1.2 U1.24 X1.1), MCU (C?#7.1 R?#4.2 U?.24 X?#1.1)
PA0_TIM2CH1: Sheet1 (JP3.1 U1.34), MCU (U?.34)
PA1_ADC1IN1: Sheet1 (JP5.1 U1.35), MCU (U?.35)
PA2_USART2: Sheet1 (JP16.2 U1.36), MCU (U?.36)
PA3_ADC1IN3: Sheet1 (JP5.3 U1.37), MCU (U?.37)
PA4_DAC1: Sheet1 (JP8.2 U1.40), MCU (U?.40)
PA5_DAC2: Sheet1 (JP8.1 U1.41), MCU (U?.41)
PA6_ADC1IN6: Sheet1 (JP5.5 U1.42), MCU (U?.42)
PA7_ADC1IN7: Sheet1 (JP5.7 U1.43), MCU (U?.43)
PA8_TIM1CH1: Sheet1 (JP2.1 U1.100), MCU (U?.100)
PA9_TIM1CH2: Sheet1 (JP2.3 U1.101), MCU (U?.101)
PA10_TIM1CH3: Sheet1 (JP2.5 U1.102), MCU (U?.102)
PA11_TIM1CH4: Sheet1 (JP2.7 U1.103), MCU (U?.103)
PA12: Sheet1 (JP14.1 U1.104), MCU (U?.104)
PA15_SPI3_NSS: Sheet1 (JP17.4 U1.110), MCU (U?.110)
PB0_TIM3CH3: Sheet1 (JP3.2 R8.2 U1.46), MCU (U?.46)
PB1_TIM3CH4: Sheet1 (JP3.4 R6.2 U1.47), MCU (U?.47)
PB3_TIM2CH2: Sheet1 (JP3.3 U1.133), MCU (U?.133)
PB4_TIM3_EN1: Sheet1 (JP4.2 U1.134), MCU (U?.134)
PB5_TIM3_EN2: Sheet1 (JP4.4 U1.135), MCU (U?.135)
PB6_USART1: Sheet1 (JP13.3 U1.136), MCU (U?.136)
PB7_USART1: Sheet1 (JP13.2 U1.137), MCU (U?.137)
PB8_TIM4CH3: Sheet1 (JP3.6 U1.139), MCU (U?.139)
PB9_TIM4CH4: Sheet1 (JP3.8 U1.140), MCU (U?.140)
PB10_TIM2CH3: Sheet1 (JP3.5 U1.69), MCU (U?.69)
PB11_TIM2CH4: Sheet1 (JP3.7 U1.70), MCU (U?.70)
PB12_CAN2_RX: Sheet1 (JP10.1 U1.73), MCU (U?.73)
PB13_CAN2_TX: Sheet1 (JP10.2 U1.74), MCU (U?.74)
PB14: Sheet1 (JP14.2 U1.75), MCU (U?.75)
PC0_ADC2IN10: Sheet1 (JP5.2 U1.26), MCU (U?.26)
PC1_ADC2IN11: Sheet1 (JP5.4 U1.27), MCU (U?.27)
PC2_ADC2IN12: Sheet1 (JP5.6 U1.28), MCU (U?.28)
PC3_ADC2IN13: Sheet1 (JP5.8 U1.29), MCU (U?.29)
PC4: Sheet1 (JP14.3 U1.44), MCU (U?.44)
PC5: Sheet1 (JP14.4 U1.45), MCU (U?.45)
PC6_TIM8CH1: Sheet1 (JP1.7 U1.96), MCU (U?.96)
PC7_TIM8CH2: Sheet1 (JP1.5 U1.97), MCU (U?.97)
PC8_TIM8CH3: Sheet1 (JP1.3 U1.98), MCU (U?.98)
PC9_TIM8CH4: Sheet1 (JP1.1 U1.99), MCU (U?.99)
PC10_SPI3_SCK: Sheet1 (JP17.3 U1.111), MCU (U?.111)
PC11_SPI3_MISO: Sheet1 (JP17.2 U1.112), MCU (U?.112)
PC12_SPI3_MOSI: Sheet1 (JP17.1 U1.113), MCU (U?.113)
PC13_KEY0: Sheet1 (JP6.1 R7.2 U1.7), MCU (U?.7)
PD0_FSMC_D2: Sheet1 (J1.25 U1.114), MCU (U?.114)
PD1_FSMC_D3: Sheet1 (J1.24 U1.115), MCU (U?.115)
PD2: Sheet1 (JP14.5 U1.116), MCU (U?.116)
PD3: Sheet1 (JP14.6 U1.117), MCU (U?.117)
PD4_FSMC_NOE: Sheet1 (J1.29 U1.118), MCU (U?.118)
PD5_FSMC_NWE: Sheet1 (J1.30 U1.119), MCU (U?.119)
PD6_USART2: Sheet1 (JP16.3 U1.122), MCU (U?.122)
PD7: Sheet1 (JP14.7 U1.123), MCU (U?.123)
PD8_FSMC_D13: Sheet1 (J1.14 U1.77), MCU (U?.77)
PD9_FSMC_D14: Sheet1 (J1.13 U1.78), MCU (U?.78)
PD10_FSMC_D15: Sheet1 (J1.12 U1.79), MCU (U?.79)
PD11_KEY1: Sheet1 (JP6.2 U1.80), MCU (U?.80)
PD12_TIM4_EN1: Sheet1 (JP4.6 U1.81), MCU (U?.81)
PD13_TIM4_EN2: Sheet1 (JP4.8 U1.82), MCU (U?.82)
PD14_FSMC_D0: Sheet1 (J1.27 U1.85), MCU (U?.85)
PD15_FSMC_D1: Sheet1 (J1.26 U1.86), MCU (U?.86)
PDR: Sheet1 (DE2.1 R2.1 U1.143), MCU (DE?.1 R?#1.1 U?.143)
PE0: Sheet1 (JP14.8 U1.141), MCU (U?.141)
PE1: Sheet1 (JP14.9 U1.142), MCU (U?.142)
PE2: Sheet1 (JP14.10 U1.1), MCU (U?.1)
PE3: Sheet1 (JP14.11 U1.2), MCU (U?.2)
PE4: Sheet1 (JP14.12 U1.3), MCU (U?.3)
PE5: Sheet1 (JP15.1 U1.4), MCU (U?.4)
PE6: Sheet1 (JP15.2 U1.5), MCU (U?.5)
PE7_FSMC_D4: Sheet1 (J1.23 U1.58), MCU (U?.58)
PE8_FSMC_D5: Sheet1 (J1.22 U1.59), MCU (U?.59)
PE9_FSMC_D6: Sheet1 (J1.21 U1.60), MCU (U?.60)
PE10_FSMC_D7: Sheet1 (J1.20 U1.63), MCU (U?.63)
PE11_FSMC_D8: Sheet1 (J1.19 U1.64), MCU (U?.64)
PE12_FSMC_D9: Sheet1 (J1.18 U1.65), MCU (U?.65)
PE13_FSMC_D10: Sheet1 (J1.17 U1.66), MCU (U?.66)
PE14_FSMC_D11: Sheet1 (J1.16 U1.67), MCU (U?.67)
PE15_FSMC_D12: Sheet1 (J1.15 U1.68), MCU (U?.68)
PF0_IIC2_SDA: Sheet1 (JP11.3 R10.2 U1.10), MCU (U?.10)
PF1_IIC2_SCL: Sheet1 (JP11.2 R11.2 U1.11), MCU (U?.11)
PF2_LED0: Sheet1 (JP9.2 R12.1 U1.12), MCU (R?#5.1 U?.12)
PF3_LED1: Sheet1 (JP9.3 R13.1 U1.13), MCU (R?#6.1 U?.13)
PF4_ADC3IN14: Sheet1 (JP7.1 U1.14), MCU (U?.14)
PF5_ADC3IN15: Sheet1 (JP7.2 U1.15), MCU (U?.15)
PF6: Sheet1 (JP15.3 U1.18), MCU (U?.18)
PF7: Sheet1 (JP15.4 U1.19), MCU (U?.19)
PF8: Sheet1 (JP15.5 U1.20), MCU (U?.20)
PF9: Sheet1 (JP15.6 U1.21), MCU (U?.21)
PF10: Sheet1 (JP15.7 U1.22), MCU (U?.22)
PF11_KEY2: Sheet1 (JP6.3 R5.2 U1.49), MCU (U?.49)
PF12_FSMC_A6: Sheet1 (J1.31 U1.50), MCU (U?.50)
PF13: Sheet1 (JP15.8 U1.53), MCU (U?.53)
PF14: Sheet1 (JP15.9 U1.54), MCU (U?.54)
PF15: Sheet1 (JP15.10 U1.55), MCU (U?.55)
PG0: Sheet1 (JP15.11 U1.56), MCU (U?.56)
PG1_KEY3: Sheet1 (JP6.4 U1.57), MCU (U?.57)
PG2: Sheet1 (JP15.12 U1.87), MCU (U?.87)
PG12_FSMC_NE4: Sheet1 (J1.32 U1.127), MCU (U?.127)
RST: Sheet1 (J1.28 R3.2 SW2.1 U1.25), MCU (R?#3.2 SW?#2.1 U?.25)
SWCLK: Sheet1 (JP12.2 U1.109), MCU (U?.109)
SWDIO: Sheet1 (JP12.3 U1.105), MCU (U?.105)
VBAT: Sheet1 (D1.3 U1.6), MCU (D?.3 U?.6)
VBAT_PIN_IN: Sheet1 (D1.2 JP9.1), MCU (D?.2)
VCAP1: Sheet1 (C10.2 U1.71), MCU (C?#1.2 U?.71)
VCAP2: Sheet1 (C11.2 U1.106), MCU (C?#2.2 U?.106)
VREF+: Sheet1 (C8.2 C9.2 R9.1 U1.32), MCU (C?#3.2 C?#4.2 R?#2.1 U?.32)